# EAGLE design Adafruit DotStar 2020 8x8 Matrix  (EAGLE 6.4)
COMPANY: ADAFRUIT INDUSTRIES; DRAWN: KTOWN; REV: A
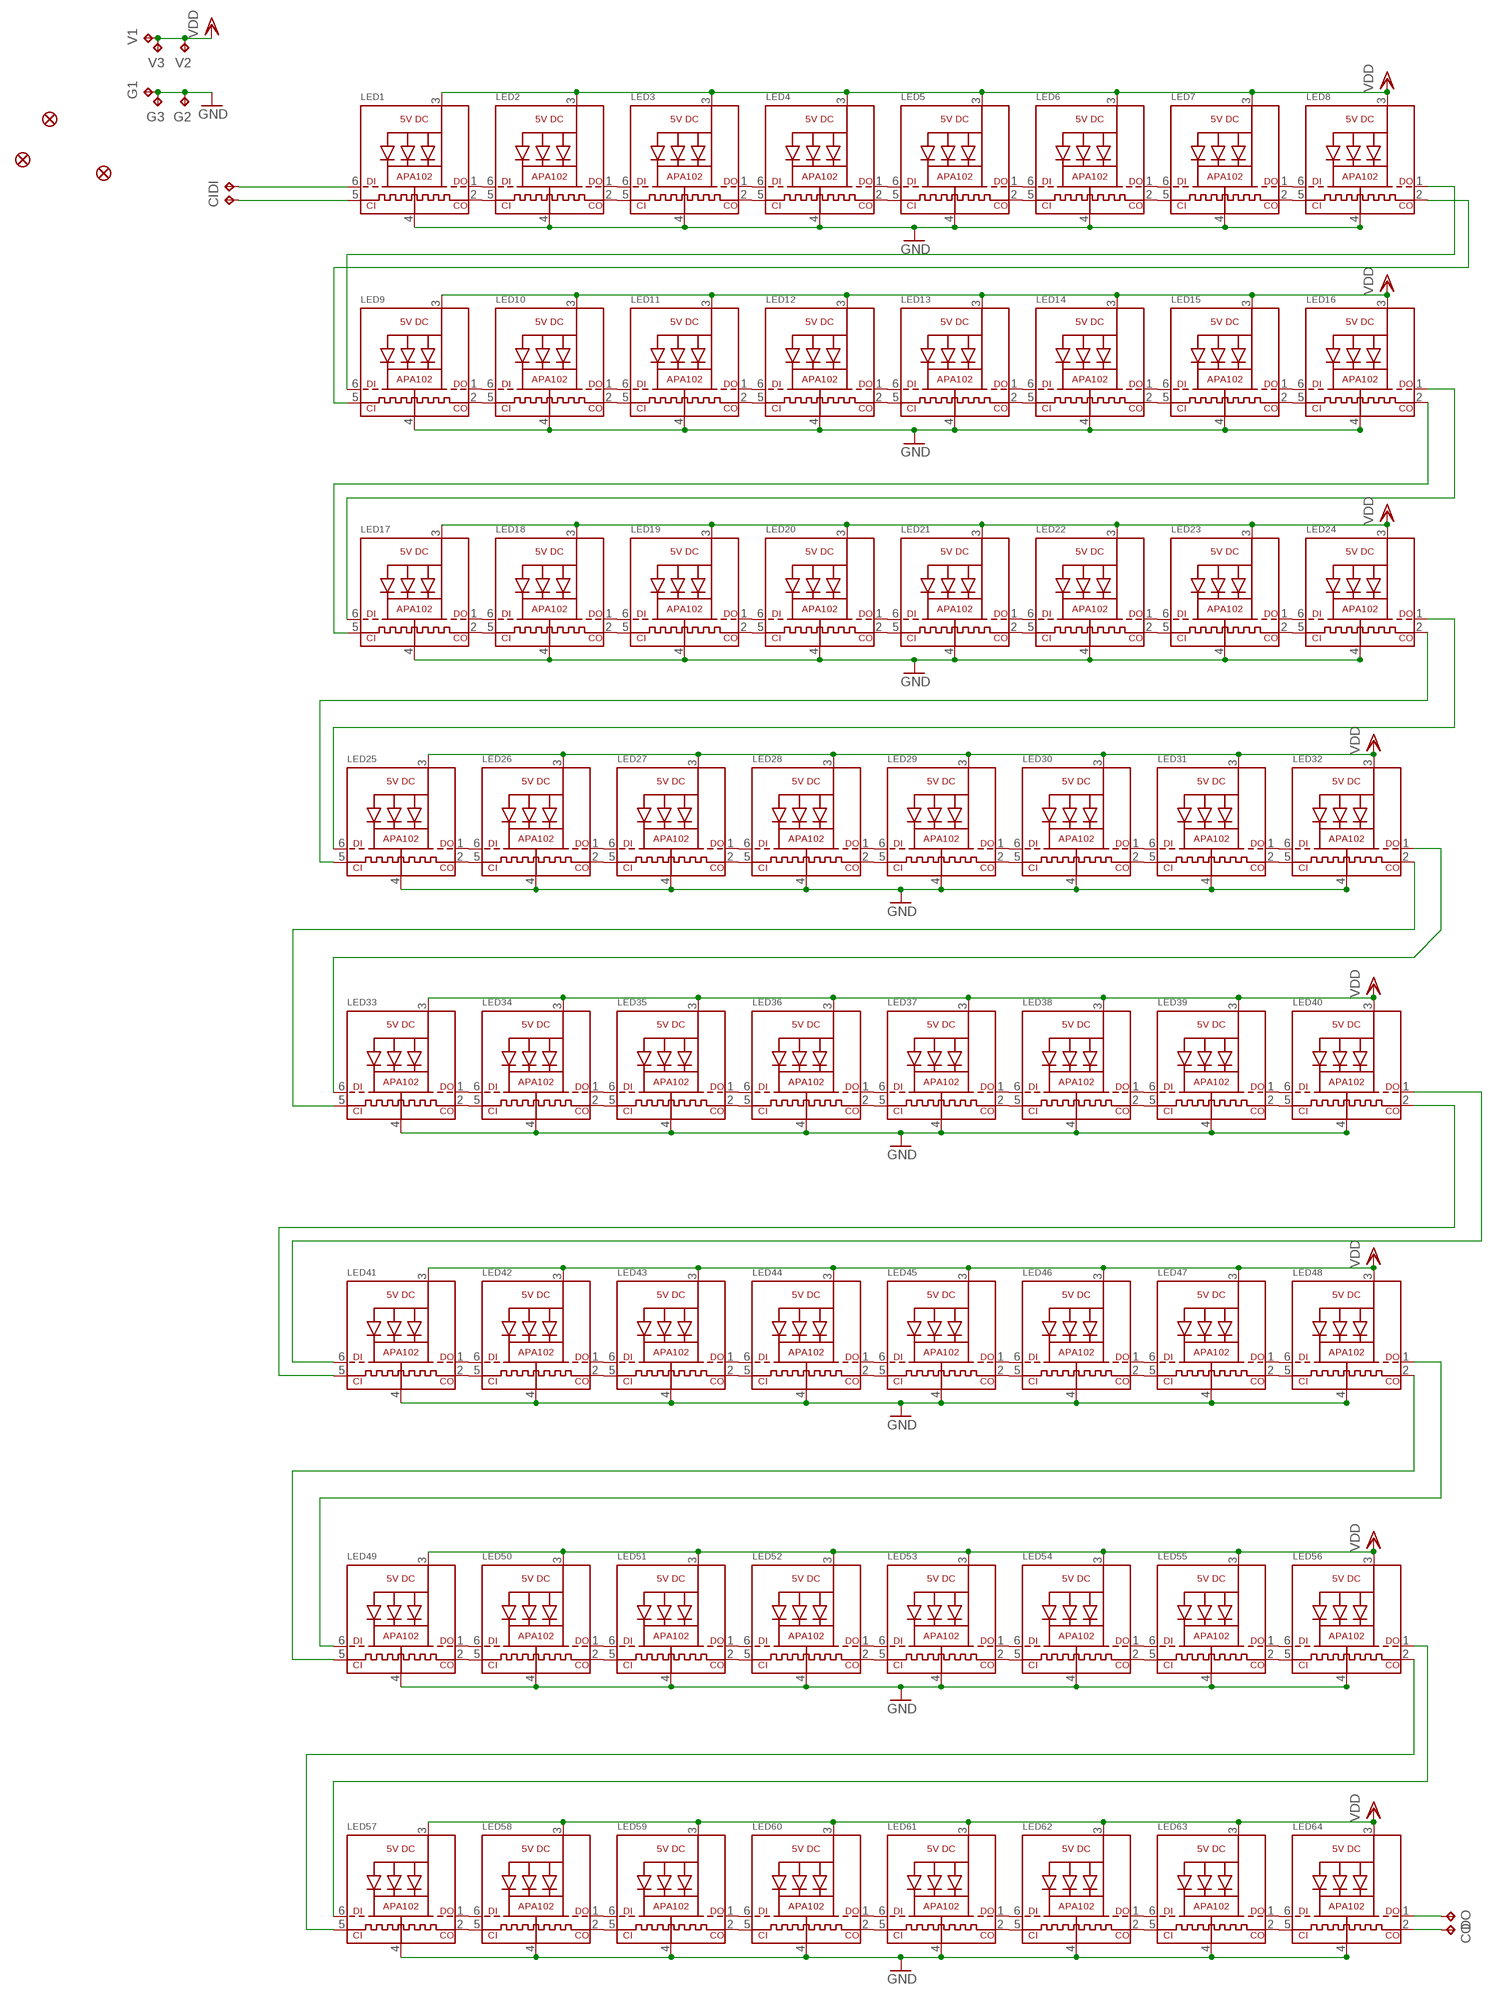
[diagram p0: schematic, sheet 1]

## Parts
CI  TPTP20R  [TP20R]
CO  TPTP20R  [TP20R]
DI  TPTP20R  [TP20R]
DO  TPTP20R  [TP20R]
FID1  FIDUCIAL_0.5MM  [FIDUCIAL_0.5MM]
FID2  FIDUCIAL_0.5MM  [FIDUCIAL_0.5MM]
FID3  FIDUCIAL_0.5MM  [FIDUCIAL_0.5MM]
G1  TPTP20R  [TP20R]
G2  TPTP20R  [TP20R]
G3  TPTP20R  [TP20R]
LED1  APA1022020  [APA102_2020]
LED2  APA1022020  [APA102_2020]
LED3  APA1022020  [APA102_2020]
LED4  APA1022020  [APA102_2020]
LED5  APA1022020  [APA102_2020]
LED6  APA1022020  [APA102_2020]
LED7  APA1022020  [APA102_2020]
LED8  APA1022020  [APA102_2020]
LED9  APA1022020  [APA102_2020]
LED10  APA1022020  [APA102_2020]
LED11  APA1022020  [APA102_2020]
LED12  APA1022020  [APA102_2020]
LED13  APA1022020  [APA102_2020]
LED14  APA1022020  [APA102_2020]
LED15  APA1022020  [APA102_2020]
LED16  APA1022020  [APA102_2020]
LED17  APA1022020  [APA102_2020]
LED18  APA1022020  [APA102_2020]
LED19  APA1022020  [APA102_2020]
LED20  APA1022020  [APA102_2020]
LED21  APA1022020  [APA102_2020]
LED22  APA1022020  [APA102_2020]
LED23  APA1022020  [APA102_2020]
LED24  APA1022020  [APA102_2020]
LED25  APA1022020  [APA102_2020]
LED26  APA1022020  [APA102_2020]
LED27  APA1022020  [APA102_2020]
LED28  APA1022020  [APA102_2020]
LED29  APA1022020  [APA102_2020]
LED30  APA1022020  [APA102_2020]
LED31  APA1022020  [APA102_2020]
LED32  APA1022020  [APA102_2020]
LED33  APA1022020  [APA102_2020]
LED34  APA1022020  [APA102_2020]
LED35  APA1022020  [APA102_2020]
LED36  APA1022020  [APA102_2020]
LED37  APA1022020  [APA102_2020]
LED38  APA1022020  [APA102_2020]
LED39  APA1022020  [APA102_2020]
LED40  APA1022020  [APA102_2020]
LED41  APA1022020  [APA102_2020]
LED42  APA1022020  [APA102_2020]
LED43  APA1022020  [APA102_2020]
LED44  APA1022020  [APA102_2020]
LED45  APA1022020  [APA102_2020]
LED46  APA1022020  [APA102_2020]
LED47  APA1022020  [APA102_2020]
LED48  APA1022020  [APA102_2020]
LED49  APA1022020  [APA102_2020]
LED50  APA1022020  [APA102_2020]
LED51  APA1022020  [APA102_2020]
LED52  APA1022020  [APA102_2020]
LED53  APA1022020  [APA102_2020]
LED54  APA1022020  [APA102_2020]
LED55  APA1022020  [APA102_2020]
LED56  APA1022020  [APA102_2020]
LED57  APA1022020  [APA102_2020]
LED58  APA1022020  [APA102_2020]
LED59  APA1022020  [APA102_2020]
LED60  APA1022020  [APA102_2020]
LED61  APA1022020  [APA102_2020]
LED62  APA1022020  [APA102_2020]
LED63  APA1022020  [APA102_2020]
LED64  APA1022020  [APA102_2020]
V1  TPTP20R  [TP20R]
V2  TPTP20R  [TP20R]
V3  TPTP20R  [TP20R]

## Nets
C0: CO.TP LED64.2(CKO)
CIN: CI.TP LED1.5(CKI)
D0: DO.TP LED64.1(DO)
DIN: DI.TP LED1.6(DI)
GND: G1.TP G2.TP G3.TP LED1.4(GND) LED2.4(GND) LED3.4(GND) LED4.4(GND) LED5.4(GND) LED6.4(GND) LED7.4(GND) LED8.4(GND) LED9.4(GND) LED10.4(GND) LED11.4(GND) LED12.4(GND) LED13.4(GND) LED14.4(GND) LED15.4(GND) LED16.4(GND) LED17.4(GND) LED18.4(GND) LED19.4(GND) LED20.4(GND) LED21.4(GND) LED22.4(GND) LED23.4(GND) LED24.4(GND) LED25.4(GND) LED26.4(GND) LED27.4(GND) LED28.4(GND) LED29.4(GND) LED30.4(GND) LED31.4(GND) LED32.4(GND) LED33.4(GND) LED34.4(GND) LED35.4(GND) LED36.4(GND) LED37.4(GND) LED38.4(GND) LED39.4(GND) LED40.4(GND) LED41.4(GND) LED42.4(GND) LED43.4(GND) LED44.4(GND) LED45.4(GND) LED46.4(GND) LED47.4(GND) LED48.4(GND) LED49.4(GND) LED50.4(GND) LED51.4(GND) LED52.4(GND) LED53.4(GND) LED54.4(GND) LED55.4(GND) LED56.4(GND) LED57.4(GND) LED58.4(GND) LED59.4(GND) LED60.4(GND) LED61.4(GND) LED62.4(GND) LED63.4(GND) LED64.4(GND)
N$1: LED1.1(DO) LED2.6(DI)
N$2: LED1.2(CKO) LED2.5(CKI)
N$3: LED2.1(DO) LED3.6(DI)
N$4: LED2.2(CKO) LED3.5(CKI)
N$5: LED3.1(DO) LED4.6(DI)
N$6: LED3.2(CKO) LED4.5(CKI)
N$7: LED4.1(DO) LED5.6(DI)
N$8: LED4.2(CKO) LED5.5(CKI)
N$9: LED5.1(DO) LED6.6(DI)
N$10: LED5.2(CKO) LED6.5(CKI)
N$11: LED6.1(DO) LED7.6(DI)
N$12: LED6.2(CKO) LED7.5(CKI)
N$13: LED7.1(DO) LED8.6(DI)
N$14: LED7.2(CKO) LED8.5(CKI)
N$15: LED9.1(DO) LED10.6(DI)
N$16: LED9.2(CKO) LED10.5(CKI)
N$17: LED10.1(DO) LED11.6(DI)
N$18: LED10.2(CKO) LED11.5(CKI)
N$19: LED11.1(DO) LED12.6(DI)
N$20: LED11.2(CKO) LED12.5(CKI)
N$21: LED12.1(DO) LED13.6(DI)
N$22: LED12.2(CKO) LED13.5(CKI)
N$23: LED13.1(DO) LED14.6(DI)
N$24: LED13.2(CKO) LED14.5(CKI)
N$25: LED14.1(DO) LED15.6(DI)
N$26: LED14.2(CKO) LED15.5(CKI)
N$27: LED15.1(DO) LED16.6(DI)
N$28: LED15.2(CKO) LED16.5(CKI)
N$29: LED17.1(DO) LED18.6(DI)
N$30: LED17.2(CKO) LED18.5(CKI)
N$31: LED18.1(DO) LED19.6(DI)
N$32: LED18.2(CKO) LED19.5(CKI)
N$33: LED19.1(DO) LED20.6(DI)
N$34: LED19.2(CKO) LED20.5(CKI)
N$35: LED20.1(DO) LED21.6(DI)
N$36: LED20.2(CKO) LED21.5(CKI)
N$37: LED21.1(DO) LED22.6(DI)
N$38: LED21.2(CKO) LED22.5(CKI)
N$39: LED22.1(DO) LED23.6(DI)
N$40: LED22.2(CKO) LED23.5(CKI)
N$41: LED23.1(DO) LED24.6(DI)
N$42: LED23.2(CKO) LED24.5(CKI)
N$43: LED25.1(DO) LED26.6(DI)
N$44: LED25.2(CKO) LED26.5(CKI)
N$45: LED26.1(DO) LED27.6(DI)
N$46: LED26.2(CKO) LED27.5(CKI)
N$47: LED27.1(DO) LED28.6(DI)
N$48: LED27.2(CKO) LED28.5(CKI)
N$49: LED28.1(DO) LED29.6(DI)
N$50: LED28.2(CKO) LED29.5(CKI)
N$51: LED29.1(DO) LED30.6(DI)
N$52: LED29.2(CKO) LED30.5(CKI)
N$53: LED30.1(DO) LED31.6(DI)
N$54: LED30.2(CKO) LED31.5(CKI)
N$55: LED31.1(DO) LED32.6(DI)
N$56: LED31.2(CKO) LED32.5(CKI)
N$57: LED33.1(DO) LED34.6(DI)
N$58: LED33.2(CKO) LED34.5(CKI)
N$59: LED34.1(DO) LED35.6(DI)
N$60: LED34.2(CKO) LED35.5(CKI)
N$61: LED35.1(DO) LED36.6(DI)
N$62: LED35.2(CKO) LED36.5(CKI)
N$63: LED36.1(DO) LED37.6(DI)
N$64: LED36.2(CKO) LED37.5(CKI)
N$65: LED37.1(DO) LED38.6(DI)
N$66: LED37.2(CKO) LED38.5(CKI)
N$67: LED38.1(DO) LED39.6(DI)
N$68: LED38.2(CKO) LED39.5(CKI)
N$69: LED39.1(DO) LED40.6(DI)
N$70: LED39.2(CKO) LED40.5(CKI)
N$71: LED41.1(DO) LED42.6(DI)
N$72: LED41.2(CKO) LED42.5(CKI)
N$73: LED42.1(DO) LED43.6(DI)
N$74: LED42.2(CKO) LED43.5(CKI)
N$75: LED43.1(DO) LED44.6(DI)
N$76: LED43.2(CKO) LED44.5(CKI)
N$77: LED44.1(DO) LED45.6(DI)
N$78: LED44.2(CKO) LED45.5(CKI)
N$79: LED45.1(DO) LED46.6(DI)
N$80: LED45.2(CKO) LED46.5(CKI)
N$81: LED46.1(DO) LED47.6(DI)
N$82: LED46.2(CKO) LED47.5(CKI)
N$83: LED47.1(DO) LED48.6(DI)
N$84: LED47.2(CKO) LED48.5(CKI)
N$85: LED49.1(DO) LED50.6(DI)
N$86: LED49.2(CKO) LED50.5(CKI)
N$87: LED50.1(DO) LED51.6(DI)
N$88: LED50.2(CKO) LED51.5(CKI)
N$89: LED51.1(DO) LED52.6(DI)
N$90: LED51.2(CKO) LED52.5(CKI)
N$91: LED52.1(DO) LED53.6(DI)
N$92: LED52.2(CKO) LED53.5(CKI)
N$93: LED53.1(DO) LED54.6(DI)
N$94: LED53.2(CKO) LED54.5(CKI)
N$95: LED54.1(DO) LED55.6(DI)
N$96: LED54.2(CKO) LED55.5(CKI)
N$97: LED55.1(DO) LED56.6(DI)
N$98: LED55.2(CKO) LED56.5(CKI)
N$99: LED57.1(DO) LED58.6(DI)
N$100: LED57.2(CKO) LED58.5(CKI)
N$101: LED58.1(DO) LED59.6(DI)
N$102: LED58.2(CKO) LED59.5(CKI)
N$103: LED59.1(DO) LED60.6(DI)
N$104: LED59.2(CKO) LED60.5(CKI)
N$105: LED60.1(DO) LED61.6(DI)
N$106: LED60.2(CKO) LED61.5(CKI)
N$107: LED61.1(DO) LED62.6(DI)
N$108: LED61.2(CKO) LED62.5(CKI)
N$109: LED62.1(DO) LED63.6(DI)
N$110: LED62.2(CKO) LED63.5(CKI)
N$111: LED63.1(DO) LED64.6(DI)
N$112: LED63.2(CKO) LED64.5(CKI)
N$113: LED8.1(DO) LED9.6(DI)
N$114: LED8.2(CKO) LED9.5(CKI)
N$115: LED16.1(DO) LED17.6(DI)
N$116: LED16.2(CKO) LED17.5(CKI)
N$117: LED24.1(DO) LED25.6(DI)
N$118: LED24.2(CKO) LED25.5(CKI)
N$119: LED32.1(DO) LED33.6(DI)
N$120: LED32.2(CKO) LED33.5(CKI)
N$121: LED56.1(DO) LED57.6(DI)
N$122: LED56.2(CKO) LED57.5(CKI)
N$123: LED48.2(CKO) LED49.5(CKI)
N$124: LED48.1(DO) LED49.6(DI)
N$125: LED40.2(CKO) LED41.5(CKI)
N$126: LED40.1(DO) LED41.6(DI)
VDD: LED1.3(VDD) LED2.3(VDD) LED3.3(VDD) LED4.3(VDD) LED5.3(VDD) LED6.3(VDD) LED7.3(VDD) LED8.3(VDD) LED9.3(VDD) LED10.3(VDD) LED11.3(VDD) LED12.3(VDD) LED13.3(VDD) LED14.3(VDD) LED15.3(VDD) LED16.3(VDD) LED17.3(VDD) LED18.3(VDD) LED19.3(VDD) LED20.3(VDD) LED21.3(VDD) LED22.3(VDD) LED23.3(VDD) LED24.3(VDD) LED25.3(VDD) LED26.3(VDD) LED27.3(VDD) LED28.3(VDD) LED29.3(VDD) LED30.3(VDD) LED31.3(VDD) LED32.3(VDD) LED33.3(VDD) LED34.3(VDD) LED35.3(VDD) LED36.3(VDD) LED37.3(VDD) LED38.3(VDD) LED39.3(VDD) LED40.3(VDD) LED41.3(VDD) LED42.3(VDD) LED43.3(VDD) LED44.3(VDD) LED45.3(VDD) LED46.3(VDD) LED47.3(VDD) LED48.3(VDD) LED49.3(VDD) LED50.3(VDD) LED51.3(VDD) LED52.3(VDD) LED53.3(VDD) LED54.3(VDD) LED55.3(VDD) LED56.3(VDD) LED57.3(VDD) LED58.3(VDD) LED59.3(VDD) LED60.3(VDD) LED61.3(VDD) LED62.3(VDD) LED63.3(VDD) LED64.3(VDD) V1.TP V2.TP V3.TP

## Library data of the parts
CI CO DI DO G1-G3 V1-V3 = testpad:TP: Test pad
FID1-FID3 = microbuilder:FIDUCIAL: Fiducial Alignment Points Various fiducial points for machine vision alignment.
LED1-LED64 = microbuilder:APA102: APA102/DotStar Pixels VCC: 5V DC Refresh Rate: 400Hz

## Board
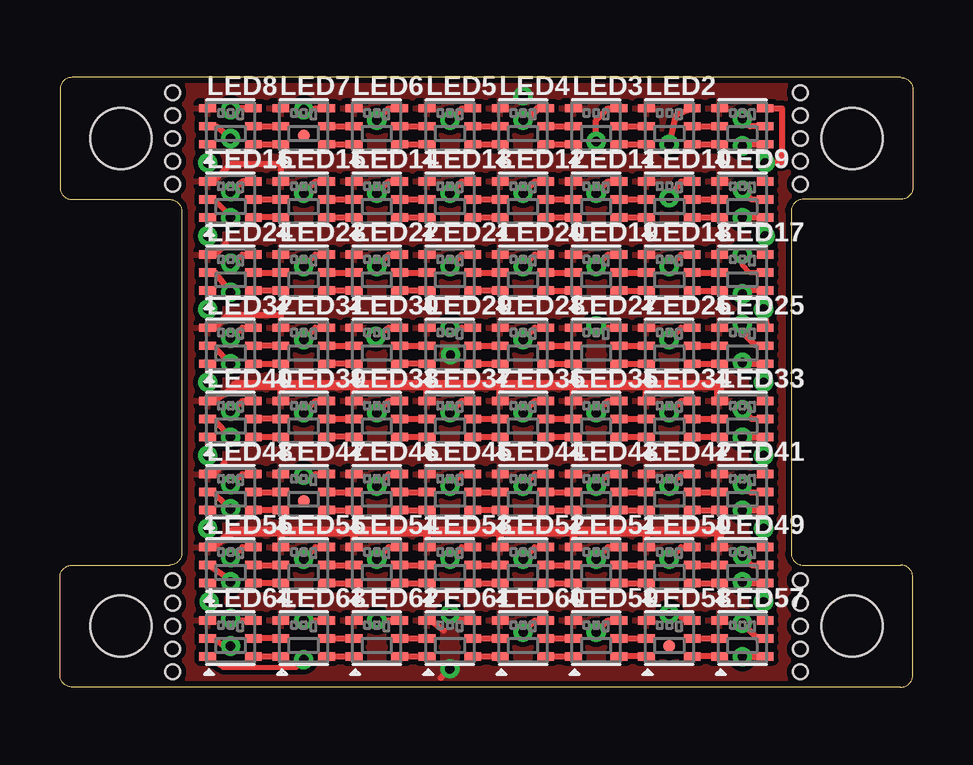
[diagram p1: board, top side]
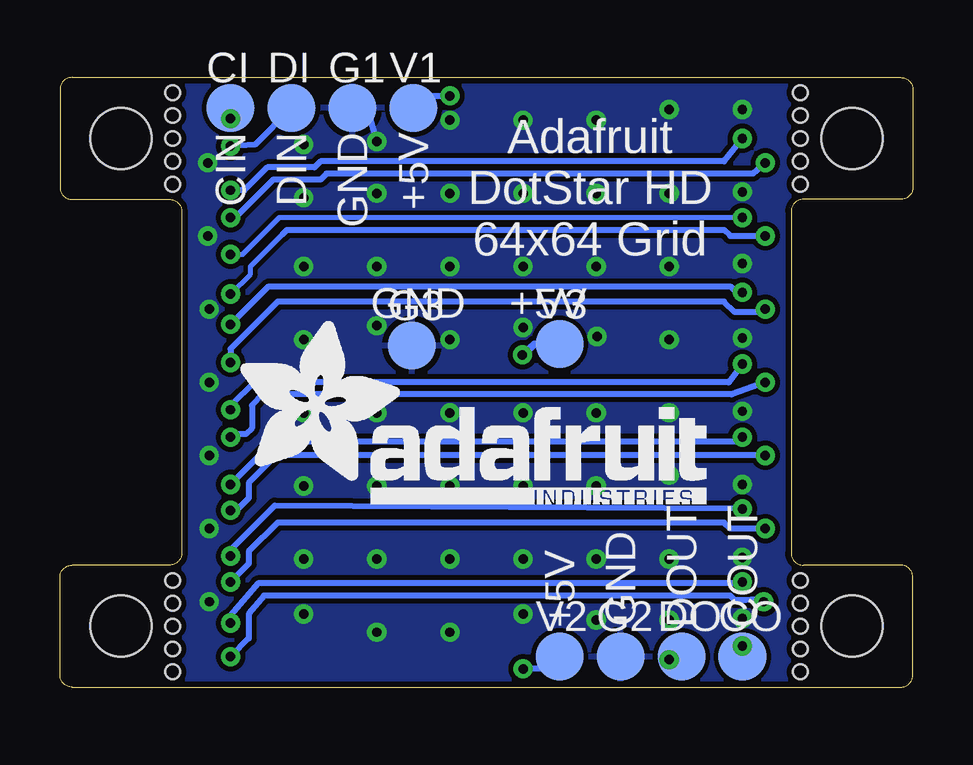
[diagram p2: board, bottom side, seen from below]

Size 35.56 x 25.4 mm. Coordinates in mm from the lower left corner, seen from the top.
Outline: 35.05,0 0.51,0 arc-90 0,0.51 0,4.57 arc-90 0.51,5.08 4.57,5.08 arc90 5.08,5.59 5.08,19.81 arc90 4.57,20.32 0.51,20.32 arc-90 0,20.83 0,24.89 arc-90 0.51,25.4 35.05,25.4 arc-90 35.56,24.89 35.56,20.83 arc-90 35.05,20.32 30.99,20.32 arc90 30.48,19.81 30.48,5.59 arc90 30.99,5.08 35.05,5.08 arc-90 35.56,4.57 35.56,0.51 arc-90 35.05,0
Copper layers (1*16): Top 0.035mm / dielectric 1.5mm / Bottom 0.035mm
Design rules "adafruit 7-7": minimum track width 6mil, minimum drill 15.5mil, track to track 8mil, track to pad 7mil, pad to pad 7mil, via to via 7mil, smd to smd 7mil, copper to edge 10mil, drill to drill 8mil, minimum pad ring 10mil, minimum via ring 8mil, stop-mask expansion 2mil, vias tented up to drill 20mil, thermal gap 10mil
Holes 2.54 mm at 2.54,2.54 2.54,22.86 33.02,22.86 33.02,2.54
Holes 0.6 mm at 4.7,0.64 4.7,1.59 4.7,2.54 4.7,4.45 4.7,3.49 4.7,20.95 4.7,21.91 4.7,22.86 4.7,24.77 4.7,23.81 30.86,24.77 30.86,23.81 30.86,22.86 30.86,20.95 30.86,21.91 30.86,4.45 30.86,3.49 30.86,2.54 30.86,0.64 30.86,1.59

### Footprints (pad centres in the part's own frame; a part is rotated, then mirrored left to right if it is on the bottom)
TP20R = smd 2 x 2: TP 0,0
FIDUCIAL_0.5MM = smd 0.5 x 0.5: 1 0,0
APA102_2020 = smd 0.7 x 0.35: 1 -0.95,-0.75; 2 -0.95,0; 3 -0.95,0.75; 4 0.95,0.75; 5 0.95,0; 6 0.95,-0.75

### Placement (x,y rotation side)
CI  28.45,24.13 0 bottom
CO  7.11,1.27 0 bottom
DI  25.91,24.13 0 bottom
DO  9.65,1.27 0 bottom
FID1  10.16,22.99 0 top
FID2  25.4,1.71 0 top
FID3  10.16,7.75 0 top
G1  23.37,24.13 0 bottom
G2  12.19,1.27 0 bottom
G3  20.89,14.22 0 bottom
LED1  28.45,23.37 0 top
LED2  25.4,23.37 0 top
LED3  22.35,23.37 0 top
LED4  19.3,23.37 0 top
LED5  16.26,23.37 0 top
LED6  13.21,23.37 0 top
LED7  10.16,23.37 0 top
LED8  7.11,23.37 0 top
LED9  28.45,20.32 0 top
LED10  25.4,20.32 0 top
LED11  22.35,20.32 0 top
LED12  19.3,20.32 0 top
LED13  16.26,20.32 0 top
LED14  13.21,20.32 0 top
LED15  10.16,20.32 0 top
LED16  7.11,20.32 0 top
LED17  28.45,17.27 0 top
LED18  25.4,17.27 0 top
LED19  22.35,17.27 0 top
LED20  19.3,17.27 0 top
LED21  16.26,17.27 0 top
LED22  13.21,17.27 0 top
LED23  10.16,17.27 0 top
LED24  7.11,17.27 0 top
LED25  28.45,14.22 0 top
LED26  25.4,14.22 0 top
LED27  22.35,14.22 0 top
LED28  19.3,14.22 0 top
LED29  16.26,14.22 0 top
LED30  13.21,14.22 0 top
LED31  10.16,14.22 0 top
LED32  7.11,14.22 0 top
LED33  28.45,11.18 0 top
LED34  25.4,11.18 0 top
LED35  22.35,11.18 0 top
LED36  19.3,11.18 0 top
LED37  16.26,11.18 0 top
LED38  13.21,11.18 0 top
LED39  10.16,11.18 0 top
LED40  7.11,11.18 0 top
LED41  28.45,8.13 0 top
LED42  25.4,8.13 0 top
LED43  22.35,8.13 0 top
LED44  19.3,8.13 0 top
LED45  16.26,8.13 0 top
LED46  13.21,8.13 0 top
LED47  10.16,8.13 0 top
LED48  7.11,8.13 0 top
LED49  28.45,5.08 0 top
LED50  25.4,5.08 0 top
LED51  22.35,5.08 0 top
LED52  19.3,5.08 0 top
LED53  16.26,5.08 0 top
LED54  13.21,5.08 0 top
LED55  10.16,5.08 0 top
LED56  7.11,5.08 0 top
LED57  28.45,2.03 0 top
LED58  25.4,2.03 0 top
LED59  22.35,2.03 0 top
LED60  19.3,2.03 0 top
LED61  16.26,2.03 0 top
LED62  13.21,2.03 0 top
LED63  10.16,2.03 0 top
LED64  7.11,2.03 0 top
U$1  [ADAFRUIT_TEXT_20MM]  28.19,7.62 0 bottom
V1  20.83,24.13 0 bottom
V2  14.73,1.27 0 bottom
V3  14.73,14.29 0 bottom

### Tracks (layer width: path | path; a pad name or v marks a point on that pad's centre or on a via)
C0  (via drill 0.39)
  Top 0.254: LED64.2 6.35,2.03 6.86,1.71 v7.11,1.71
  Bottom 0.254: v7.11,1.71 6.79,1.59 CO.TP
CIN  (via drill 0.39)
  Top 0.254: LED1.5 28.77,23.37 v28.45,23.69
  Bottom 0.254: CI.TP v28.45,23.69
D0  (via drill 0.39)
  Top 0.203: 6.16,1.2 6.79,0.83 9.84,0.83 v10.16,1.14
  Top 0.254: LED64.1 6.16,1.2
  Bottom 0.254: v10.16,1.14 9.34,1.27 DO.TP
DIN  (via drill 0.39)
  Top 0.254: v28.45,22.54 28.4,22.62 LED1.6
  Bottom 0.254: DI.TP 27.43,22.61 v28.45,22.54
GND  (via drill 0.39)
  Top 0.254: LED16.4 7.61,21.07 v7.11,20.64 | v7.11,17.65 7.61,18.02 LED24.4 | v10.16,17.53 10.66,18.02 LED23.4 | v13.21,17.53 13.7,18.02 LED22.4 | v13.21,20.57 13.7,21.07 LED14.4 | v10.16,20.57 10.66,21.07 LED15.4 | v16.26,20.57 16.75,21.07 LED13.4 | v16.26,17.53 16.75,18.02 LED21.4 | v7.11,14.54 7.61,14.97 LED32.4 | v7.11,11.49 7.61,11.93 LED40.4 | v10.16,11.43 10.66,11.93 LED39.4 | v13.21,11.43 13.7,11.93 LED38.4 | v10.16,14.48 10.66,14.97 LED31.4 | v13.17,14.61 13.7,14.97 LED30.4 | v16.26,14.99 16.75,14.97 LED29.4 | v19.3,14.48 19.8,14.97 LED28.4 | v19.3,17.53 19.8,18.02 LED20.4 | v22.35,17.53 22.85,18.02 LED19.4 | v22.35,15.06 22.85,14.97 LED27.4 | v16.26,11.43 16.75,11.93 LED37.4 | v19.3,11.43 19.8,11.93 LED36.4 | v22.35,11.43 22.85,11.93 LED35.4 | v25.4,17.53 25.9,18.02 LED18.4 | v25.4,20.38 25.9,21.07 LED10.4 | v22.35,20.57 22.85,21.07 LED11.4 | v19.3,20.57 19.8,21.07 LED12.4 | v25.4,14.48 25.9,14.97 LED26.4 | v29.34,15.75 29.45,15.1 LED25.4 | v29.34,12.7 29.26,11.99 LED33.4 | v25.4,11.43 25.9,11.93 LED34.4 | v7.11,2.86 7.61,2.78 LED64.4 | v7.11,5.4 7.61,5.83 LED56.4 | v10.16,5.33 10.66,5.83 LED55.4 | v10.16,2.79 10.66,2.78 LED63.4 | v13.21,2.79 13.7,2.78 LED62.4 | v16.26,3.05 16.64,2.79 | v19.3,2.29 19.8,2.78 LED60.4 | v19.3,5.33 19.8,5.83 LED52.4 | v16.26,5.33 16.75,5.83 LED53.4 | v13.21,5.33 13.7,5.83 LED54.4 | v10.16,8.83 10.66,8.88 LED47.4 | v7.11,8.45 7.61,8.88 LED48.4 | v13.21,8.38 13.7,8.88 LED46.4 | v16.26,8.38 16.75,8.88 LED45.4 | v19.3,8.38 19.8,8.88 LED44.4 | v22.35,8.38 22.85,8.88 LED43.4 | v22.35,5.33 22.85,5.83 LED51.4 | v22.35,2.29 22.85,2.78 LED59.4 | v25.4,3.05 25.46,3.24 25.53,3.17 26.09,2.78 LED58.4 | v29.34,3.56 29.33,2.78 LED57.4
  Top 0.254: v29.34,6.6 29.33,5.83 LED49.4 | v25.4,5.33 25.9,5.83 LED50.4 | v25.4,8.38 25.9,8.88 LED42.4 | v29.34,9.65 29.33,8.88 LED41.4 | LED17.4 v29.4,18.8 | LED9.4 29.34,21.39 v29.4,21.84 30.1,21.84 30.1,24.12 LED1.4 | LED8.4 7.16,24.12 v7.11,24.07 | v10.16,24.07 10.66,24.12 LED7.4 | v13.21,23.62 13.7,24.12 LED6.4 | v16.26,23.62 16.75,24.12 LED5.4 | v19.3,23.62 19.43,23.75 19.56,23.75 | v22.35,22.73 22.35,23.62 22.85,24.12 LED3.4 | v25.4,22.61 25.7,23.86 LED2.4
  Top 0.305: LED61.4 16.88,2.78 16.64,2.79 | LED4.4 19.93,24.12 19.56,23.75
  Bottom 0.254: G1.TP 22.73,24.07 v22.35,22.73
  pour Bottom: 5.08,0 5.08,25.4 30.48,25.4 30.48,0
N$1
  Top 0.254: LED2.6 LED1.1
N$2
  Top 0.254: LED2.5 LED1.2
N$3
  Top 0.254: LED3.6 LED2.1
N$4
  Top 0.254: LED3.5 LED2.2
N$5
  Top 0.254: LED4.6 LED3.1
N$6
  Top 0.254: LED4.5 LED3.2
N$7
  Top 0.254: LED5.6 LED4.1
N$8
  Top 0.254: LED5.5 LED4.2
N$9
  Top 0.254: LED6.6 LED5.1
N$10
  Top 0.254: LED6.5 LED5.2
N$11
  Top 0.254: LED7.6 LED6.1
N$12
  Top 0.254: LED7.5 LED6.2
N$13
  Top 0.254: LED8.6 LED7.1
N$14
  Top 0.254: LED8.5 LED7.2
N$15
  Top 0.254: LED10.6 LED9.1
N$16
  Top 0.254: LED10.5 LED9.2
N$17
  Top 0.254: LED11.6 LED10.1
N$18
  Top 0.254: LED11.5 LED10.2
N$19
  Top 0.254: LED12.6 LED11.1
N$20
  Top 0.254: LED12.5 LED11.2
N$21
  Top 0.254: LED13.6 LED12.1
N$22
  Top 0.254: LED13.5 LED12.2
N$23
  Top 0.254: LED14.6 LED13.1
N$24
  Top 0.254: LED14.5 LED13.2
N$25
  Top 0.254: LED15.6 LED14.1
N$26
  Top 0.254: LED15.5 LED14.2
N$27
  Top 0.254: LED15.1 LED16.6
N$28
  Top 0.254: LED16.5 LED15.2
N$29
  Top 0.254: LED18.6 LED17.1
N$30
  Top 0.254: LED18.5 LED17.2
N$31
  Top 0.254: LED19.6 LED18.1
N$32
  Top 0.254: LED19.5 LED18.2
N$33
  Top 0.254: LED20.6 LED19.1
N$34
  Top 0.254: LED20.5 LED19.2
N$35
  Top 0.254: LED20.1 LED21.6
N$36
  Top 0.254: LED21.5 LED20.2
N$37
  Top 0.254: LED21.1 LED22.6
N$38
  Top 0.254: LED22.5 LED21.2
N$39
  Top 0.254: LED22.1 LED23.6
N$40
  Top 0.254: LED23.5 LED22.2
N$41
  Top 0.254: LED23.1 LED24.6
N$42
  Top 0.254: LED24.5 LED23.2
N$43
  Top 0.254: LED26.6 LED25.1
N$44
  Top 0.254: LED26.5 LED25.2
N$45
  Top 0.254: LED27.6 LED26.1
N$46
  Top 0.254: LED27.5 LED26.2
N$47
  Top 0.254: LED28.6 LED27.1
N$48
  Top 0.254: LED28.5 LED27.2
N$49
  Top 0.254: LED29.6 LED28.1
N$50
  Top 0.254: LED29.5 LED28.2
N$51
  Top 0.254: LED29.1 LED30.6
N$52
  Top 0.254: LED30.5 LED29.2
N$53
  Top 0.254: LED30.1 LED31.6
N$54
  Top 0.254: LED31.5 LED30.2
N$55
  Top 0.254: LED32.6 LED31.1
N$56
  Top 0.254: LED31.2 LED32.5
N$57
  Top 0.254: LED34.6 LED33.1
N$58
  Top 0.254: LED34.5 LED33.2
N$59
  Top 0.254: LED35.6 LED34.1
N$60
  Top 0.254: LED35.5 LED34.2
N$61
  Top 0.254: LED36.6 LED35.1
N$62
  Top 0.254: LED36.5 LED35.2
N$63
  Top 0.254: LED37.6 LED36.1
N$64
  Top 0.254: LED37.5 LED36.2
N$65
  Top 0.254: LED38.6 LED37.1
N$66
  Top 0.254: LED38.5 LED37.2
N$67
  Top 0.254: LED38.1 LED39.6
N$68
  Top 0.254: LED39.5 LED38.2
N$69
  Top 0.254: LED40.6 LED39.1
N$70
  Top 0.254: LED39.2 LED40.5
N$71
  Top 0.254: LED42.6 LED41.1
N$72
  Top 0.254: LED42.5 LED41.2
N$73
  Top 0.254: LED43.6 LED42.1
N$74
  Top 0.254: LED43.5 LED42.2
N$75
  Top 0.254: LED44.6 LED43.1
N$76
  Top 0.254: LED44.5 LED43.2
N$77
  Top 0.254: LED44.1 LED45.6
N$78
  Top 0.254: LED45.5 LED44.2
N$79
  Top 0.254: LED46.6 LED45.1
N$80
  Top 0.254: LED46.5 LED45.2
N$81
  Top 0.254: LED47.6 LED46.1
N$82
  Top 0.254: LED47.5 LED46.2
N$83
  Top 0.254: LED47.1 LED48.6
N$84
  Top 0.254: LED48.5 LED47.2
N$85
  Top 0.254: LED50.6 LED49.1
N$86
  Top 0.254: LED50.5 LED49.2
N$87
  Top 0.254: LED51.6 LED50.1
N$88
  Top 0.254: LED51.5 LED50.2
N$89
  Top 0.254: LED52.6 LED51.1
N$90
  Top 0.254: LED52.5 LED51.2
N$91
  Top 0.254: LED53.6 LED52.1
N$92
  Top 0.254: LED53.5 LED52.2
N$93
  Top 0.254: LED54.6 LED53.1
N$94
  Top 0.254: LED54.5 LED53.2
N$95
  Top 0.254: LED55.6 LED54.1
N$96
  Top 0.254: LED55.5 LED54.2
N$97
  Top 0.254: LED55.1 LED56.6
N$98
  Top 0.254: LED56.5 LED55.2
N$99
  Top 0.254: LED57.1 LED58.6
N$100
  Top 0.254: LED58.5 LED57.2
N$101
  Top 0.254: LED58.1 LED59.6
N$102
  Top 0.254: LED59.5 LED58.2
N$103
  Top 0.254: LED60.6 LED59.1
N$104
  Top 0.254: LED60.5 LED59.2
N$105
  Top 0.254: LED61.6 LED60.1
N$106
  Top 0.254: LED61.5 LED60.2
N$107
  Top 0.254: LED62.6 LED61.1
N$108
  Top 0.254: LED62.5 LED61.2
N$109
  Top 0.254: LED63.6 LED62.1
N$110
  Top 0.254: LED63.5 LED62.2
N$111
  Top 0.254: LED64.6 LED63.1
N$112
  Top 0.254: LED63.2 LED64.5
N$113  (via drill 0.39)
  Top 0.254: LED8.1 6.16,22.3 v6.16,21.84 | v28.45,19.56 28.33,19.57 LED9.6
  Bottom 0.254: 6.16,22.1 v6.16,21.84 6.67,21.4 24.45,21.4 24.7,21.14 26.67,21.14 28.26,19.56 | 28.26,19.56 28.19,19.56 | 28.26,19.56 v28.45,19.56
N$114  (via drill 0.39)
  Top 0.254: LED8.2 6.54,23.37 v7.11,22.86 | v28.45,20.7 28.83,20.32 LED9.5
  Bottom 0.254: v7.11,22.86 7.87,21.91 24.7,21.91 24.95,21.65 26.92,21.65 27.88,20.7 v28.45,20.7
N$115  (via drill 0.39)
  Top 0.203: LED16.1 6.16,19.37 v6.16,18.8 | LED17.6 28.59,16.52 v28.45,16.38
  Bottom 0.203: 26.29,18.86 27.62,17.53 27.62,17.21 v28.45,16.38
  Bottom 0.254: 26.29,18.86 26.1,19.05 7.87,19.05 7.62,18.8 v6.16,18.8
N$116  (via drill 0.39)
  Top 0.203: LED16.2 6.41,20.32 7.05,19.68 v7.11,19.56 | LED17.5 28.77,17.27 28.45,17.59 v28.45,18.03
  Bottom 0.203: v7.11,19.56 26.42,19.56 27.94,18.03 v28.45,18.03
N$117  (via drill 0.39)
  Top 0.254: LED24.1 v6.16,15.75 | v28.45,13.53 28.5,13.47 LED25.6
  Bottom 0.254: v6.16,15.75 6.41,15.62 7.43,15.62 7.87,16.07 26.48,16.07 28.45,14.1 v28.45,13.53
N$118  (via drill 0.39)
  Top 0.254: LED25.5 29.02,14.22 28.45,14.8 v28.45,15.11 | v7.11,16.45 6.48,17.27 LED24.2
  Bottom 0.254: v28.45,15.11 26.86,16.7 7.62,16.7 7.37,16.45 v7.11,16.45
N$119  (via drill 0.39)
  Top 0.254: LED32.1 v6.16,12.7 | v28.45,10.41 29.39,10.41 LED33.6
  Bottom 0.254: v6.16,12.7 7.56,12.19 27.12,12.19 27.56,11.73 27.56,10.79 27.81,10.54 28.32,10.54 v28.45,10.41
N$120  (via drill 0.39)
  Top 0.254: LED32.2 6.41,14.22 v7.11,13.46 | v28.45,11.56 28.83,11.18 LED33.5
  Bottom 0.254: v7.11,13.46 7.68,12.7 27.47,12.7 28.45,11.75 v28.45,11.56
N$121  (via drill 0.39)
  Top 0.254: LED56.1 6.22,4.27 v6.22,3.56 | v28.45,1.27 29.39,1.27 LED57.6
  Bottom 0.254: v6.22,3.56 6.35,3.68 6.99,3.62 7.43,3.62 7.62,3.81 27.05,3.81 27.69,3.05 27.69,2.03 v28.45,1.27
N$122  (via drill 0.39)
  Top 0.254: LED56.2 6.22,5.08 7.05,4.51 v7.11,4.38 | v28.45,2.67 29.08,2.03 LED57.5
  Bottom 0.254: v7.11,4.38 7.37,4.32 27.3,4.32 28.45,2.98 v28.45,2.67
N$123  (via drill 0.39)
  Top 0.254: LED48.2 6.35,8.13 v7.11,7.43 | v28.45,5.46 28.83,5.08 LED49.5
  Bottom 0.254: v7.11,7.43 26.61,7.56 28.45,5.71 v28.45,5.46
N$124  (via drill 0.39)
  Top 0.254: LED48.1 6.24,6.73 v6.16,6.6 | v28.45,4.38 28.44,4.33 LED49.6
  Bottom 0.254: v28.45,4.38 27.69,5.14 27.69,5.65 26.48,6.86 7.87,6.86 7.62,6.6 v6.16,6.6
N$125  (via drill 0.39)
  Top 0.254: LED40.2 6.41,11.18 v7.11,10.41 | v28.45,8.45 28.77,8.13 LED41.5
  Bottom 0.254: v7.11,10.41 7.3,10.22 26.67,10.22 v28.45,8.45
N$126  (via drill 0.39)
  Top 0.254: LED40.1 v6.16,9.65 | v28.45,7.37 29.39,7.37 LED41.6
  Bottom 0.254: v6.16,9.65 26.54,9.65 27.69,8.51 27.69,7.87 28.19,7.37 v28.45,7.37
VDD  (via drill 0.39)
  Top 0.254: 6.34,2.78 LED64.3 | LED16.3 6.4,21.07 7.11,21.78 9.21,21.78 LED15.3 | LED24.3 6.46,18.02 6.92,18.48 | LED32.3 6.46,14.97 6.99,15.49 9.21,15.49 LED31.3 | v16.26,0.76 15.88,0.38 | LED61.3 15.44,2.78 16,2.35 | LED48.3 6.4,8.88 6.86,9.34
  Top 0.305: 7.3,12.57 7.05,12.32 6.35,11.94 6.34,11.93 LED40.3 | LED39.3 9.21,12.57 11.56,12.57 | LED38.3 12.26,12.57 12.19,12.57 | LED37.3 15.31,12.57 15.18,12.57 | LED36.3 18.35,12.57 18.41,12.57 | LED35.3 21.4,12.57 | LED34.3 24.45,12.57 24.57,12.57 | 7.24,6.48 6.35,5.84 LED56.3 | LED55.3 9.21,6.48 9.65,6.48 | LED54.3 12.26,6.48 12.19,6.48 | LED53.3 15.31,6.48 15.37,6.48 | LED52.3 18.35,6.48 | LED51.3 21.4,6.48 21.78,6.48 | LED50.3 24.45,6.48 24.7,6.48 | v16.28,13.84 16.18,14.02 16.23,14.07
  Top 0.406: 27.43,2.78 LED57.3 | LED33.3 27.5,12.57 24.57,12.57 21.4,12.57 18.41,12.57 15.18,12.57 12.19,12.57 11.56,12.57 7.3,12.57 | LED49.3 27.5,6.48 24.7,6.48 21.78,6.48 18.35,6.48 15.37,6.48 12.19,6.48 9.65,6.48 7.24,6.48
  Bottom 0.254: V1.TP 20.32,24.64 v19.3,24.64 | V2.TP 15.24,0.76 v16.26,0.76
  Bottom 0.305: V3.TP 15.79,14.29 v16.28,13.84
  pour Top: 5.08,25.4 5.08,0 30.48,0 30.48,25.4

### Text on the board
bPlace: +5V | GND | DIN | CIN | Adafruit / DotStar HD / 64x64 Grid | +5V | GND | GND | COUT | DOUT | +5V